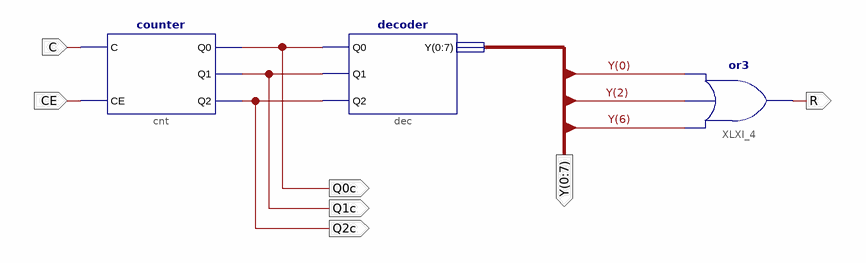
[diagram p0: schematic sheet 1]
// Xilinx ISE schematic main.sch (xc9500xl) as structural Verilog: 3 symbols, 7 ports
module main (
  input  C,
  input  CE,
  output Q0c,
  output Q1c,
  output Q2c,
  output [0:7] Y,
  output R
);

  counter cnt (.C(C), .CE(CE), .Q0(Q0c), .Q1(Q1c), .Q2(Q2c));
  decoder dec (.Q0(Q0c), .Q1(Q1c), .Q2(Q2c), .Y(Y));
  or XLXI_4 (R, Y[6], Y[2], Y[0]);
endmodule
